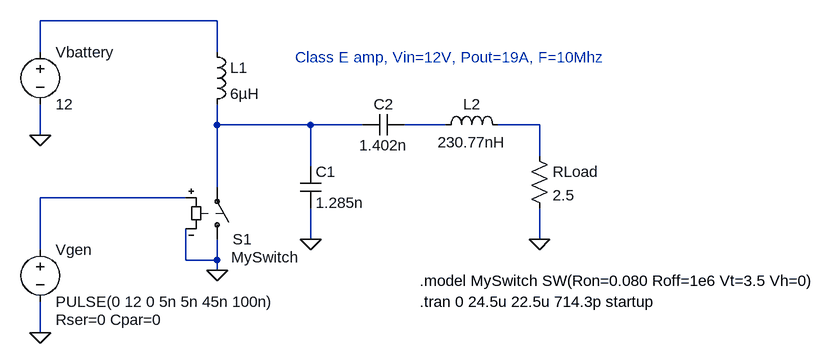
[diagram p0: schematic classe-plain-10Mhz-tuned.asc]
classe-plain-10Mhz-tuned.asc, the LTspice schematic file:
Version 4
SHEET 1 1296 248
WIRE 272 -272 0 -272
WIRE 0 -224 0 -272
WIRE 272 -224 272 -272
WIRE 272 -112 272 -144
WIRE 416 -112 272 -112
WIRE 496 -112 416 -112
WIRE 624 -112 560 -112
WIRE 768 -112 704 -112
WIRE 0 -96 0 -144
WIRE 768 -64 768 -112
WIRE 416 -48 416 -112
WIRE 272 -16 272 -112
WIRE 224 0 0 0
WIRE 416 64 416 16
WIRE 768 64 768 16
WIRE 0 80 0 0
WIRE 224 96 224 48
WIRE 272 96 272 64
WIRE 272 96 224 96
WIRE 272 112 272 96
WIRE 0 208 0 160
FLAG 0 208 0
FLAG 272 112 0
FLAG 0 -96 0
FLAG 416 64 0
FLAG 768 64 0
SYMBOL voltage 0 -240 R0
WINDOW 123 24 132 Left 2
WINDOW 39 0 0 Left 2
SYMATTR InstName Vbattery
SYMATTR Value 12
SYMBOL voltage 0 64 R0
WINDOW 123 24 132 Left 2
WINDOW 39 24 124 Left 2
SYMATTR InstName Vgen
SYMATTR Value PULSE(0 12 0 5n 5n 45n 100n)
SYMATTR SpiceLine Rser=0 Cpar=0
SYMBOL ind 256 -240 R0
SYMATTR InstName L1
SYMATTR Value 6µH
SYMBOL cap 400 -48 R0
SYMATTR InstName C1
SYMATTR Value 1.285n
SYMBOL cap 560 -128 R90
WINDOW 0 0 32 VBottom 2
WINDOW 3 32 32 VTop 2
SYMATTR InstName C2
SYMATTR Value 1.402n
SYMBOL ind 608 -96 R270
WINDOW 0 32 56 VTop 2
WINDOW 3 5 56 VBottom 2
SYMATTR InstName L2
SYMATTR Value 230.77nH
SYMBOL res 752 -80 R0
SYMATTR InstName RLoad
SYMATTR Value 2.5
SYMBOL sw 272 80 M180
WINDOW 3 22 -12 Left 2
SYMATTR InstName S1
SYMATTR Value MySwitch
TEXT 584 160 Left 2 !.tran 0 24.5u 22.5u 714.3p startup
TEXT 584 128 Left 2 !.model MySwitch SW(Ron=0.080 Roff=1e6 Vt=3.5 Vh=0)
TEXT 392 -216 Left 2 ;Class E amp, Vin=12V, Pout=19A, F=10Mhz

The netlist it stands for:
* classe-plain-10Mhz-tuned.asc
Vbattery N001 0 12
Vgen N005 0 PULSE(0 12 0 5n 5n 45n 100n) Rser=0 Cpar=0
L1 N001 N002 6µH
C1 N002 0 1.285n
C2 N003 N002 1.402n
L2 N003 N004 230.77nH
RLoad N004 0 2.5
S1 0 N002 N005 0 MySwitch
.tran 0 24.5u 22.5u 714.3p startup
.model MySwitch SW(Ron=0.080 Roff=1e6 Vt=3.5 Vh=0)
* Class E amp, Vin=12V, Pout=19A, F=10Mhz
.backanno
.end